# Altium schematic sheet Presencia_Agua.SchDoc
size Letter
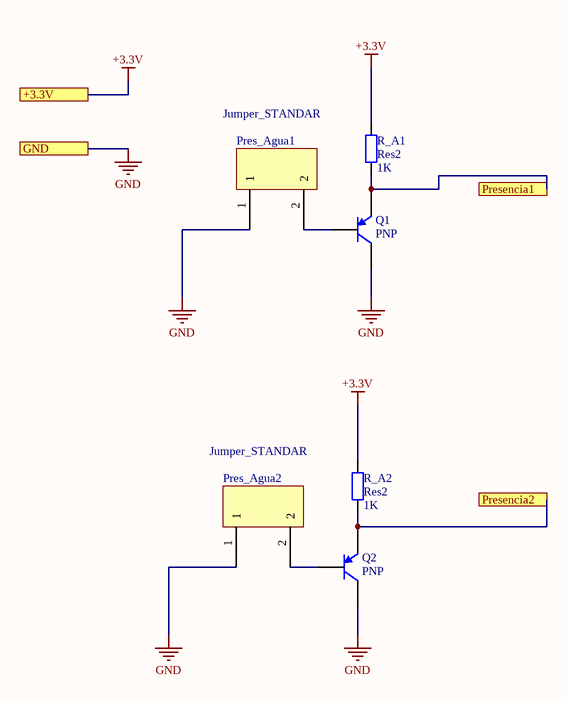
[diagram p0: Presencia_Agua.SchDoc]

## Parts
Pres_Agua1  Jumper_STANDAR  [HDR1X2H]
Pres_Agua2  Jumper_STANDAR  [HDR1X2H]
Q1  PNP  [SOT-23B_N]
Q2  PNP  [SOT-23B_N]
R_A1  Res2  value 1K  [AXIAL-0.4]
R_A2  Res2  value 1K  [AXIAL-0.4]

## Ports
+3.3V, GND, Presencia1, Presencia2

## Nets
+3.3V: R_A1.2 R_A2.2 ; port +3.3V
GND: Pres_Agua1.1 Pres_Agua2.1 Q1.1(C) Q2.1(C) ; port GND
Presencia1: Q1.3(E) R_A1.1 ; port Presencia1
Presencia2: Q2.3(E) R_A2.1 ; port Presencia2
NetPres_Agua1_2: Pres_Agua1.2 Q1.2(B)
NetPres_Agua2_2: Pres_Agua2.2 Q2.2(B)

## Library data of the parts
Q1 Q2 = PNP: PNP Bipolar Transistor; Published: 8-Jun-2000; LatestRevisionDate: 29-May-2009; LatestRevisionNote: IPC-7351 Footprint Added.; PackageVersion: Aug-1999; PackageReference: SOT-23B; Publisher: Altium Limited; PackageDescription: 3-Pin SOT-23 Package 0.95 mm Pitch, 2.4 mm Lead Span
R_A1 R_A2 = Res2: Resistor; Published: 8-Jun-2000; LatestRevisionDate: 17-Jul-2002; LatestRevisionNote: Re-released for DXP Platform.; PackageReference: AXIAL-0.4; Publisher: Altium Limited; PackageDescription: Axial Device, Thru-Hole; 2 Leads; 0.4 in Pin Spacing